# Altium schematic sheet 8-SensorsAndJTAG.SchDoc
size 431 x 279 mm; Organization: ORGANIZATION; Address1: ADDRESS 1; Address2: ADDRESS 2; Address3: ADDRESS 3; Address4: ADDRESS 4; DocumentNumber: 8; Revision: -; SheetNumber: 8; SheetTotal: 14; ENG_APP_DATE: --/--/--; DSN_APP_DATE: --/--/--; CHK_APP_DATE: --/--/--
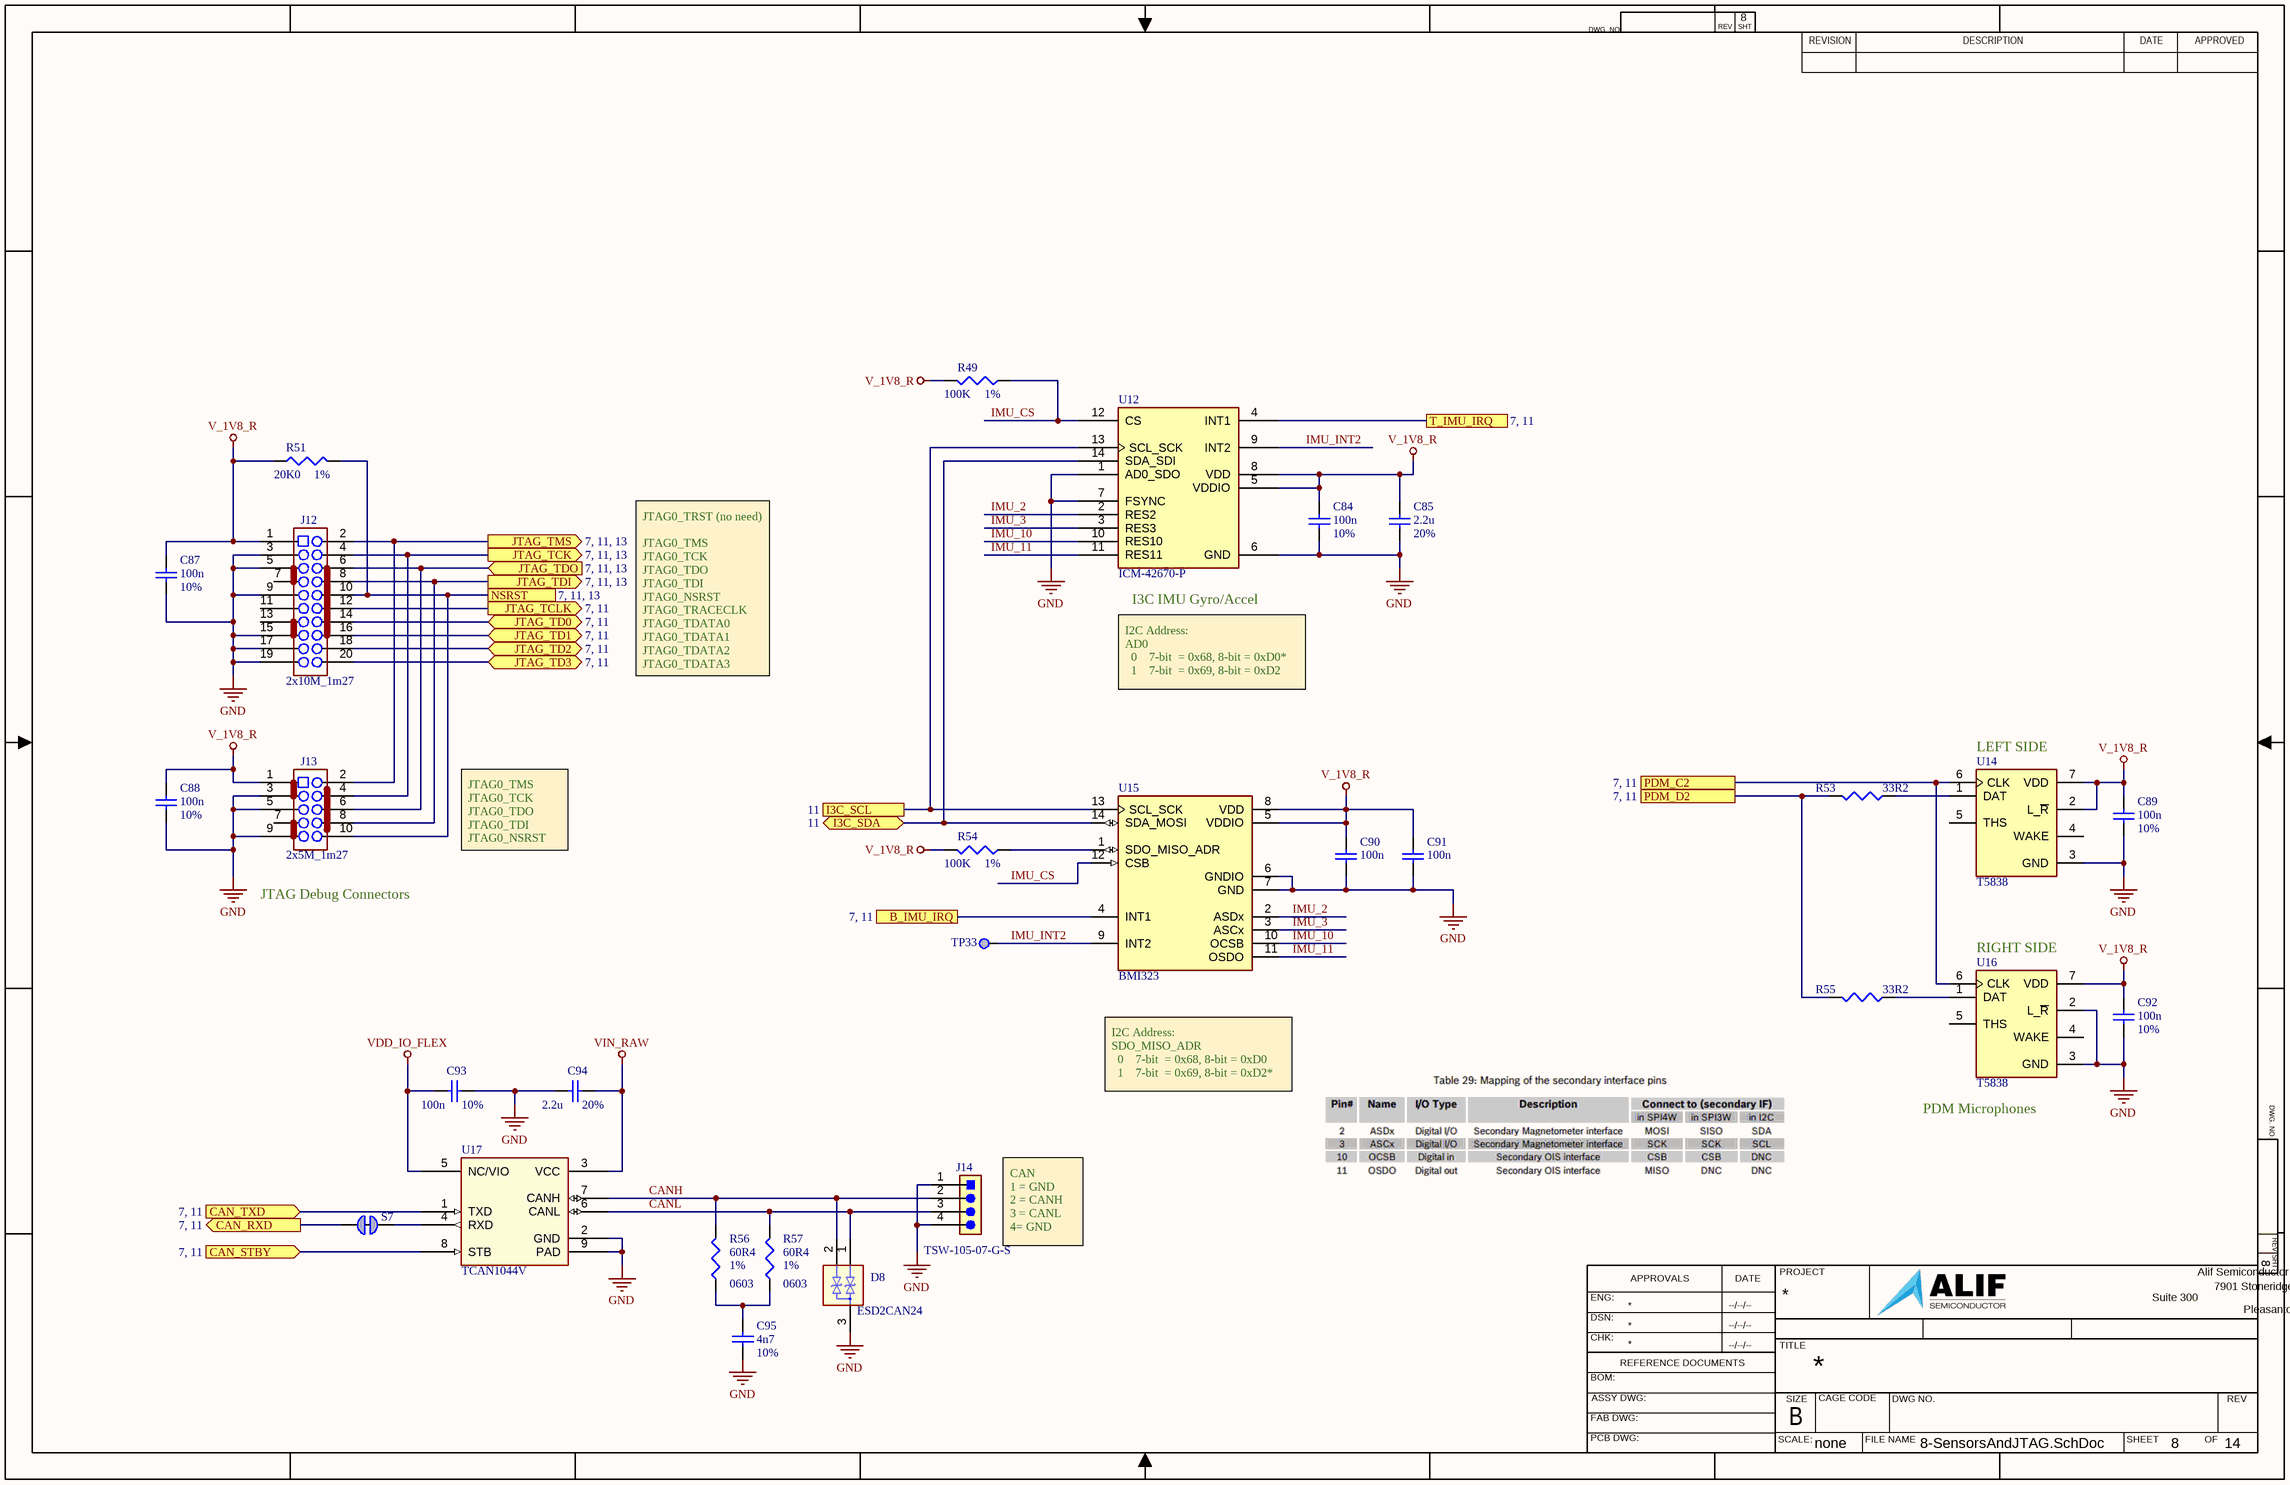
[diagram p0: 8-SensorsAndJTAG.SchDoc]

## Parts
C84  value 100n  Tolerance: 10%  [CAPC0402-01]  (hidden comment: Cap)
C85  value 2.2u  Tolerance: 20%  [CAPC0402-01]  (hidden comment: Cap_225M25VX5R0402_1)
C87  value 100n  Tolerance: 10%  [CAPC0402-01]  (hidden comment: Cap)
C88  value 100n  Tolerance: 10%  [CAPC0402-01]  (hidden comment: Cap)
C89  value 100n  Tolerance: 10%  [CAPC0402-01]  (hidden comment: Cap)
C90  value 100n  [CAPC0402-01]  (hidden comment: Cap)
C91  value 100n  [CAPC0402-01]  (hidden comment: Cap)
C92  value 100n  Tolerance: 10%  [CAPC0402-01]  (hidden comment: Cap)
C93  value 100n  Tolerance: 10%  [CAPC0402-01]  (hidden comment: Cap)
C94  value 2.2u  Tolerance: 20%  [CAPC0402-01]  (hidden comment: Cap_225M25VX5R0402_1)
C95  value 4n7  Tolerance: 10%  [CAPC0402-01]  (hidden comment: Cap)
D8  ESD2CAN24  [WE-TVS_SOT23-3L]
J12  value 2x10M_1m27  [SAMTEC_FTSH-110-01-X-DV-007-K]  (hidden comment: Hdr_M_2X10_1M27_STRT_KEY_CORTEX_1)
J13  value 2x5M_1m27  [SAMTEC_FTSH-105-01-DV-007-K]  (hidden comment: Hdr_M_2X5_1M27_STRT_KEY_CORTEX_1)
J14  TSW-105-07-G-S  [CONN_HDR_1X4_STRT_0.100]
R49  value 100K  Tolerance: 1%  [RESC0402-01]  (hidden comment: Res3)
R51  value 20K0  Tolerance: 1%  [RESC0402-01]  (hidden comment: Res3)
R53  value 33R2  [RESC0402-01]  (hidden comment: Res3)
R54  value 100K  Tolerance: 1%  [RESC0402-01]  (hidden comment: Res3)
R55  value 33R2  [RESC0402-01]  (hidden comment: Res3)
R56  value 60R4  PCB_Footprint: 0603  Tolerance: 1%  [RESC0603-01]  (hidden comment: Res3)
R57  value 60R4  PCB_Footprint: 0603  Tolerance: 1%  [RESC0603-01]  (hidden comment: Res3)
S7  SolderJumperShorted_Small  [Solderbridge_Shorted]  (value not drawn)  (net tie, no BOM)
TP33  TP_SMPAD  [TP_30_RND]  (value not drawn)  (no BOM)
U12  Manufacturer Part Number 1: ICM-42670-P  [IC_ICM-42670-P]  (hidden comment: ICM-42670-P_1)
U14  T5838  [MIC_T5838]
U15  BMI323  [PQFN50P250X300X88-14N]
U16  T5838  [MIC_T5838]
U17  TCAN1044V  [DFN8_2x3_SON8_DRB_TEX-M]

## Ports
B_IMU_IRQ (see 7, 11), CAN_RXD (out, see 7, 11), CAN_STBY (in, see 7, 11), CAN_TXD (in, see 7, 11), I3C_SCL (see 11), I3C_SDA (bidir, see 11), JTAG_TCK (out, see 7, 11, 13), JTAG_TCLK (out, see 7, 11), JTAG_TD0 (bidir, see 7, 11), JTAG_TD1 (bidir, see 7, 11), JTAG_TD2 (bidir, see 7, 11), JTAG_TD3 (bidir, see 7, 11), JTAG_TDI (out, see 7, 11, 13), JTAG_TDO (in, see 7, 11, 13), JTAG_TMS (out, see 7, 11, 13), NSRST (see 7, 11, 13), PDM_C2 (see 7, 11), PDM_D2 (see 7, 11), T_IMU_IRQ (see 7, 11)

## Nets
GND: C84.2 C85.1 C87.2 C88.2 C89.2 C90.2 C91.2 C92.2 C93.1 C94.2 C95.1 D8.3 J12.3 J12.5 J12.9 J12.15 J12.17 J12.19 J13.3 J13.5 J13.9 J14.1 J14.4 U12.1(AD0_SDO) U12.6(GND) U12.7(FSYNC) U14.3(GND) U15.6(GNDIO) U15.7(GND) U16.2(L_~{R}) U16.3(GND) U17.2(GND) U17.9(PAD)
V_1V8_R: C84.1 C85.2 C87.1 C88.1 C89.1 C90.1 C91.1 C92.1 J12.1 J13.1 R49.2 R51.1 R54.2 U12.5(VDDIO) U12.8(VDD) U14.2(L_~{R}) U14.7(VDD) U15.5(VDDIO) U15.8(VDD) U16.7(VDD)
VDD_IO_FLEX: C93.2 U17.5(NC/VIO)
VIN_RAW: C94.1 U17.3(VCC)
B_IMU_IRQ: U15.4(INT1) ; port B_IMU_IRQ
CAN_RXD: S7.1 ; port CAN_RXD
CAN_STBY: U17.8(STB) ; port CAN_STBY
CAN_TXD: U17.1(TXD) ; port CAN_TXD
CANH: D8.2 J14.2 R56.2 U17.7(CANH)
CANL: D8.1 J14.3 R57.2 U17.6(CANL)
I3C_SCL: U12.13(SCL_SCK) U15.13(SCL_SCK) ; port I3C_SCL
I3C_SDA: U12.14(SDA_SDI) U15.14(SDA_MOSI) ; port I3C_SDA
IMU_2: U12.2(RES2) U15.2(ASDx)
IMU_3: U12.3(RES3) U15.3(ASCx)
IMU_10: U12.10(RES10) U15.10(OCSB)
IMU_11: U12.11(RES11) U15.11(OSDO)
IMU_CS: R49.1 U12.12(CS) U15.12(CSB)
IMU_INT2: TP33.1 U12.9(INT2) U15.9(INT2)
JTAG_TCK: J12.4 J13.4 ; port JTAG_TCK
JTAG_TCLK: J12.12 ; port JTAG_TCLK
JTAG_TD0: J12.14 ; port JTAG_TD0
JTAG_TD1: J12.16 ; port JTAG_TD1
JTAG_TD2: J12.18 ; port JTAG_TD2
JTAG_TD3: J12.20 ; port JTAG_TD3
JTAG_TDI: J12.8 J13.8 ; port JTAG_TDI
JTAG_TDO: J12.6 J13.6 ; port JTAG_TDO
JTAG_TMS: J12.2 J13.2 ; port JTAG_TMS
NSRST: J12.10 J13.10 R51.2 ; port NSRST
PDM_C2: U14.6(CLK) U16.6(CLK) ; port PDM_C2
PDM_D2: R53.2 R55.2 ; port PDM_D2
T_IMU_IRQ: U12.4(INT1) ; port T_IMU_IRQ
NetC95_2: C95.2 R56.1 R57.1
NetR53_1: R53.1 U14.1(DAT)
NetR54_1: R54.1 U15.1(SDO_MISO_ADR)
NetR55_1: R55.1 U16.1(DAT)
NetS7_2: S7.2 U17.4(RXD)

Not connected (* = marked no-connect by the designer): J12 7 11 13; J13 7; U14 4(WAKE) 5(THS); U16 4(WAKE) 5(THS)

## Notes on the sheet
- (near U12) I3C IMU Gyro/Accel
- JTAG0_TRST (no need)
  JTAG0_TMS
  JTAG0_TCK
  JTAG0_TDO
  JTAG0_TDI
  JTAG0_NSRST
  JTAG0_TRACECLK
  JTAG0_TDATA0
  JTAG0_TDATA1
  JTAG0_TDATA2
  JTAG0_TDATA3
- I2C Address:
  AD0
  0    7-bit  = 0x68, 8-bit = 0xD0*
  1    7-bit  = 0x69, 8-bit = 0xD2
- (near U14) LEFT SIDE
- (near J13) JTAG Debug Connectors
- JTAG0_TMS
  JTAG0_TCK
  JTAG0_TDO
  JTAG0_TDI
  JTAG0_NSRST
- (near U16) RIGHT SIDE
- I2C Address:
  SDO_MISO_ADR
  0    7-bit  = 0x68, 8-bit = 0xD0
  1    7-bit  = 0x69, 8-bit = 0xD2*
- (near U16) PDM Microphones
- (near J14) CAN
  1 = GND
  2 = CANH
  3 = CANL
  4= GND
- DWG. NO.
- REV
- SHT
- REVISION
- DESCRIPTION
- DATE
- APPROVED
- ENG:
- APPROVALS
- PROJECT
- Suite 300
- Alif Semiconductor
- 7901 Stoneridge Drive
- DSN:
- CHK:
- REFERENCE DOCUMENTS
- TITLE
- Pleasanton, CA 94588  USA
- BOM:
- FAB DWG:
- PCB DWG:
- ASSY DWG:
- SCALE:
- SIZE
- B
- CAGE CODE
- FILE NAME
- DWG NO.
- SHEET
- OF
- none

## Library data of the parts
C84 C87-C93 = Cap: Cap,100nF,10%,50V,X7R,0402; Manufacturer 1: TDK; Manufacturer Part Number 1: C1005X7R1H104K050BE; PCB_Footprint: CC0402; Published: 8-Jun-2000; LatestRevisionDate: 17-Jul-2002; LatestRevisionNote: Re-released for DXP Platform.; PackageReference: RAD-0.3; Publisher: Altium Limited; PackageDescription: Radial Cap, Thru-Hole; 2 Leads; 0.3 in Pin Spacing; Max_Height: 0.60mm; Manufacturer 2: Samsung; Manufacturer Part Number 2: CL05B104KB54PNC; Manufacturer 3: Walsin; Manufacturer Part Number 3: 0402B104K500CT; Type: X7R; Voltage: 50V
  C90 C91: Tolerance: 10%
C85 C94 = Cap_225M25VX5R0402_1: Cap,2.2uF,20%,25V,X5R,0402; Manufacturer 1: TDK; Manufacturer Part Number 1: C1005X5R1E225M050BC; PCB_Footprint: CC0402; Published: 8-Jun-2000; LatestRevisionDate: 17-Jul-2002; LatestRevisionNote: Re-released for DXP Platform.; PackageReference: RAD-0.3; Publisher: Altium Limited; PackageDescription: Radial Cap, Thru-Hole; 2 Leads; 0.3 in Pin Spacing; Max_Height: 0.60mm; Manufacturer 2: Murata; Manufacturer Part Number 2: GRM155R61E225ME11D; Manufacturer 3: Murata; Manufacturer Part Number 3: GRM155R61E225ME15D; Type: X5R; Voltage: 25V
C95 = Cap: Cap,4.7nF,10%,100V,X7R,0402; Manufacturer 1: MuRata; Manufacturer Part Number 1: GCM155R72A472KA37D; PCB_Footprint: CC0402; Published: 8-Jun-2000; LatestRevisionDate: 17-Jul-2002; LatestRevisionNote: Re-released for DXP Platform.; PackageReference: RAD-0.3; Publisher: Altium Limited; PackageDescription: Radial Cap, Thru-Hole; 2 Leads; 0.3 in Pin Spacing; Max_Height: 0.60mm; Manufacturer 2: Wurth; Manufacturer Part Number 2: 885012205084; Manufacturer 3: Vishay; Manufacturer Part Number 3: VJ0402Y472KXBAC; Type: X7R; Voltage: 100V
D8 = D_ESD_ESD2CAN24DBZRQ1: Diode,TVS  – High Speed Series, SOT23-3, 2 Channel, 24Vdc, 12pF; Manufacturer 1: TI; Manufacturer Part Number 1: ESD2CAN24DBZRQ1; Manufacturer 2: Nexpheria; Manufacturer Part Number 2: PESD2CAN24T-QR
J12 = Hdr_M_2X10_1M27_STRT_KEY_CORTEX_1: Hdr,Male,2x10,1.27mm,Strt,Keyed,Cortex-JTAG; Manufacturer 1: Samtec; Manufacturer Part Number 1: FTSH-110-01-L-DV-007-K; PCB_Footprint: FTSH-110-01-X-DV-007-K
J13 = Hdr_M_2X5_1M27_STRT_KEY_CORTEX_1: Hdr,Male,2x5,1.27mm,Strt,Keyed,Cortex-JTAG; Manufacturer 1: Samtec; PCB_Footprint: FTSH-105-01-L-DV-007-K; Manufacturer Part Number 1: FTSH-105-01-L-DV-007-K
J14 = Hdr_M_1X4_2M54_STRT_UNSHROUD: Hdr, 0.025" SQ Post Header, Thru-hole, Vertical, 2.54 mm Pitch, 4-Pin, Male, RoHS; Manufacturer: Samtec; Manufacturer Part Number 1: TSW-104-07-G-S; Pitch: 2.54 mm; ComponentLink3URL: http://www.samtec.com/documents/webfiles/cpdf/TSW-XXX-XX-XXX-X-XX-XXX-MKT.pdf; Temperature Range: -55 to 125 degC; DatasheetVersion: F-214; ComponentLink1Description: Manufacturer URL; ComponentLink2URL: http://www.samtec.com/documents/webfiles/pdf/TSW_TH.PDF; RoHS: True; Orientation: Vertical; ComponentLink2Description: Datasheet; ComponentLink3Description: Package Specification; PackageDescription: .025[0.64] SQ. Post Terminal Strip Assembly; Mounting Technology: Through-hole; PackageVersion: DM, 8/1988; ComponentLink1URL: http://www.samtec.com; PackageReference: *; PartNumber: *; Manufacturer 1: Samtec
R49 R54 = Res3: Res,100K,1%,100ppm,0402; Manufacturer 1: Stackpol; Manufacturer Part Number 1: RMCF0402FT100K; Wattage: 63mW; Published: 8-Jun-2000; LatestRevisionDate: 29-May-2009; LatestRevisionNote: IPC-7351 Footprint Added.; PackageReference: RESC0402-01; Publisher: Altium Limited; PackageDescription: Chip Resistor; Voltage: *; Type: Thick Film; Manufacturer 2: Yageo; Manufacturer Part Number 2: RC0402FR-07100KL; Manufacturer 3: Bourns; Manufacturer Part Number 3: CR0402-FX-1003GLF; PCB_Footprint: RESC0402-01
R51 = Res3: Res,20K0,1%,100ppm,0402; Manufacturer 1: Stackpol; Manufacturer Part Number 1: RMCF0402FT20K0; Wattage: 63mW; Published: 8-Jun-2000; LatestRevisionDate: 29-May-2009; LatestRevisionNote: IPC-7351 Footprint Added.; PackageReference: RESC0402-01; Publisher: Altium Limited; PackageDescription: Chip Resistor; Voltage: *; Type: Thick Film; Manufacturer 2: Yageo; Manufacturer Part Number 2: RC0402FR-0720KL; Manufacturer 3: Bourns; Manufacturer Part Number 3: CR0402-FX-2002GLF; PCB_Footprint: RESC0402-01
R53 R55 = Res3: Res,33R2,1%,100ppm,0402; Manufacturer 1: Stackpol; Manufacturer Part Number 1: RMCF0402FT33R2; Wattage: 63mW; Published: 8-Jun-2000; LatestRevisionDate: 29-May-2009; LatestRevisionNote: IPC-7351 Footprint Added.; PackageReference: RESC0402-01; Publisher: Altium Limited; PackageDescription: Chip Resistor; Voltage: *; Type: Thick Film; Manufacturer 2: Yageo; Manufacturer Part Number 2: RC0402FR-0733R2L; Manufacturer 3: Bourns; Manufacturer Part Number 3: CR0402-FX-33R2GLF; PCB_Footprint: RESC0402-01; Tolerance: 1%
R56 R57 = Res3: Res,60R4,1%,100ppm,0603; Manufacturer 1: KOA; Manufacturer Part Number 1: RK73H1JTTD60R4F; Wattage: 100mW; Published: 8-Jun-2000; LatestRevisionDate: 29-May-2009; LatestRevisionNote: IPC-7351 Footprint Added.; PackageReference: 0603; Publisher: Altium Limited; PackageDescription: Chip Resistor; Voltage: *; Type: Thick Film; Manufacturer 2: Yageo; Manufacturer Part Number 2: RC0603FR-0760R4L; Manufacturer 3: Vishay; Manufacturer Part Number 3: CRCW060360R4FKEA
S7 = SolderJumperShorted_Small: DNI,Solderable Jumper,Shorted; Wattage: 63mW; PCB_Footprint: SSHORTED; Published: 8-Jun-2000; LatestRevisionDate: 29-May-2009; LatestRevisionNote: IPC-7351 Footprint Added.; PackageReference: J1-0603; Publisher: Altium Limited; PackageDescription: Chip Resistor; Voltage: *; Type: Thick Film; Manufacturer 1: *; Manufacturer Part Number 1: *; Manufacturer 2: *; Manufacturer Part Number 2: *; Manufacturer 3: *; Manufacturer Part Number 3: *; Tolerance: *; Value: *
TP33 = TP_SMPAD: DNI,Test Point, SMT Pad,--not a BOM item--; PCB_Footprint: TP_PAD1
U12 = ICM-42670-P_1: IC, IMU Gyro & Accel, I3C, 1.8V, LGA14; Manufacturer 1: TDK_Invensense; Value: Gyro_Accel
U14 U16 = MIC_T5838: IC,Microphone,PDM,Bottom Port,Sens -37db,SNR 68dbA,AOP 13db SPL,1.8V; Manufacturer 1: TDK; Manufacturer Part Number 1: MMICT5838-00-012; Value: PDM Mic; Voltage: *; Current: *; Tolerance: *; Max_Height: 0.60mm; PCB_Footprint: T5838
U15 = IC_IMU_BMI323: IC,IMU,6 Axis Sensor I3C, SPI, LGA14; MF: Bosch; Digi-Key_Purchase_URL: https://www.digikey.com/product-detail/en/bosch-sensortec/BNO055/828-1058-1-ND/6136309?utm_source=snapeda&utm_medium=aggregator&utm_campaign=symbol; Value: *; Package: LGA-14 Bosch; Manufacturer Part Number 1: BMI323; SnapEDA_Link: https://www.snapeda.com/parts/BNO055/Bosch%20Sensortec/view-part/51961/?ref=snap; Digi-Key_Part_Number: *; Manufacturer 1: Bosch; Manufacturer Prt Number 1: BMI323
U17 = IC_CAN_TCAN1044VDRBRQ1: IC, CAN Transceiver, 1.7V-5.5V, DFN8(2x3); Manufacturer 1: TI; Manufacturer Part Number 1: TCAN1044VDRBRQ1; Type: Type